# Altium schematic sheet MCU AVR ATmega2560-16AU.SchDoc
size 209 x 297 mm; Author: Мурашкин Д.В.; Address1: Address1; Address2: Address2; Address3: Address3; Address4: Address4; DocumentNumber: АБВГ.123456.001 Э3; Scale: 1:1; Letter1Column: Э; PartName: Деталь; DocumentName: 2
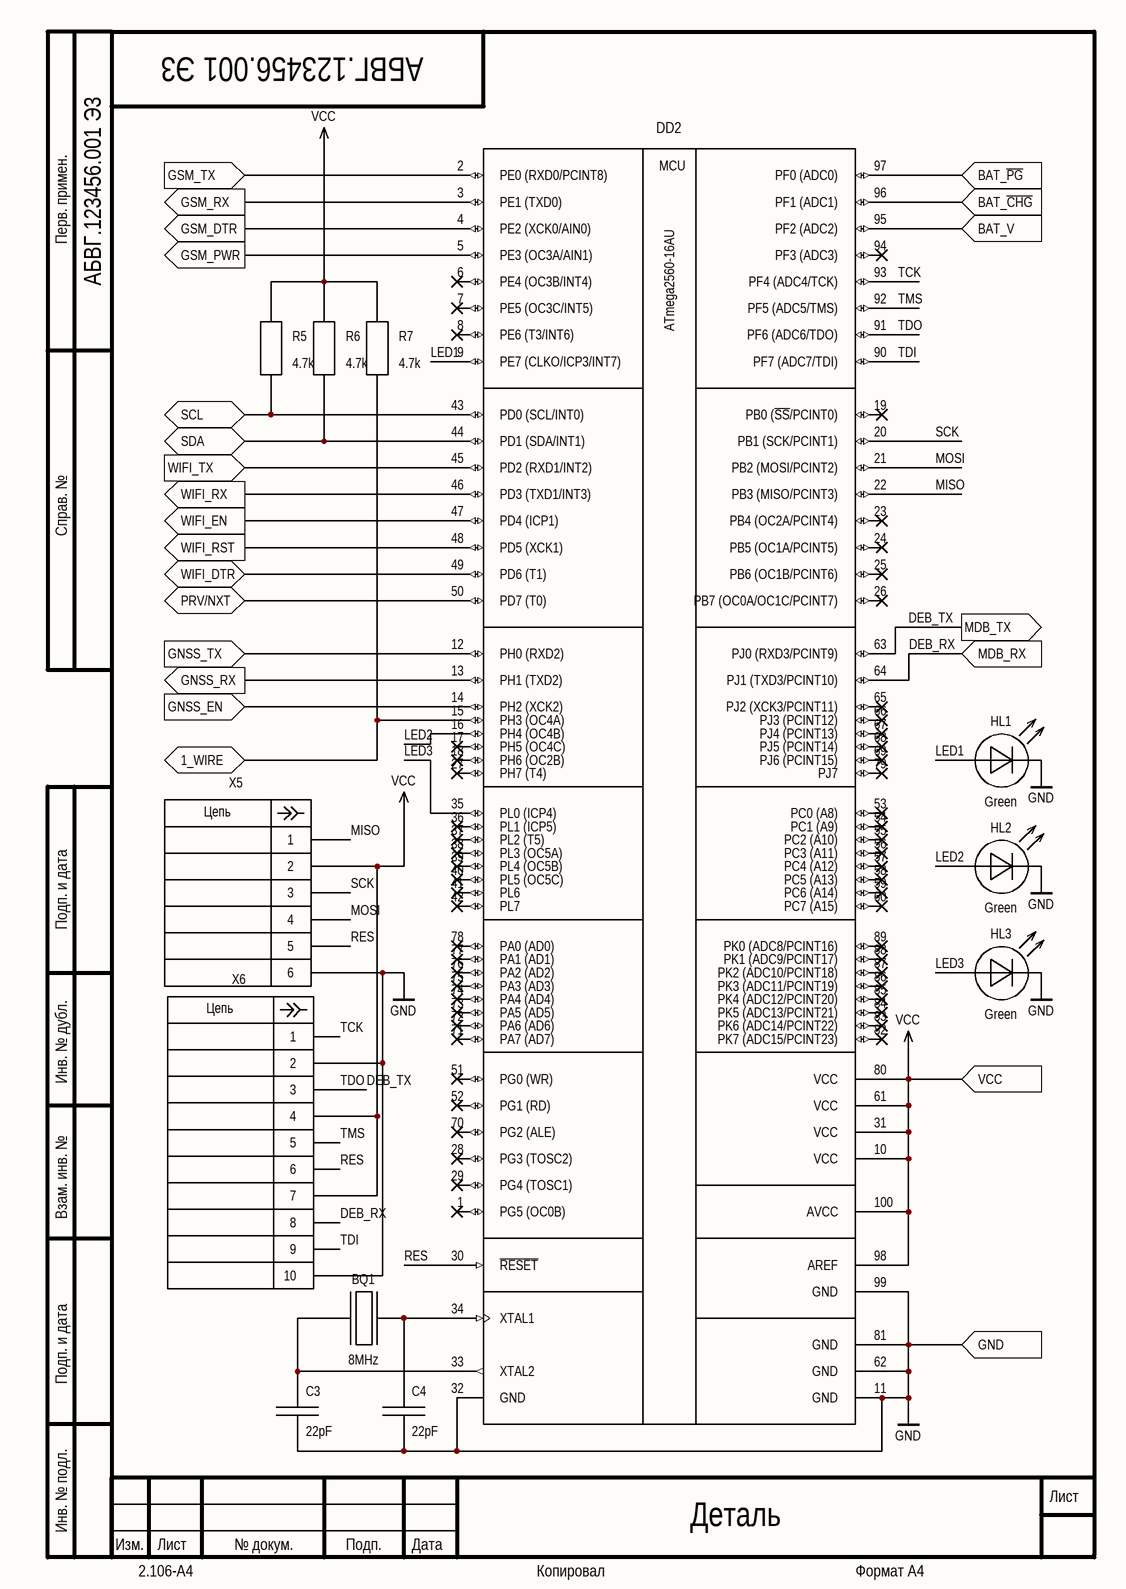
[diagram p0: MCU AVR ATmega2560-16AU.SchDoc]

## Parts
BQ1  8MHz  [HC-49S]
C3  22pF  [CAPC1608L]
C4  22pF  [CAPC1608L]
DD2  ATmega2560-16AU  [TQFP-100N]
HL1  Green  [LED 2012N]
HL2  Green  [LED 2012N]
HL3  Green  [LED 2012N]
R5  4.7k  [RESC1608L]
R6  4.7k  [RESC1608L]
R7  4.7k  [RESC1608L]
X5  Atmel ISP connector  [Atmel ISP]  (value not drawn)  (no BOM)
X6  Atmel ICE AVR JTAG connector  [Atmel ICE Connector]  (value not drawn)  (net tie, no BOM)

## Ports
1_WIRE (bidir), BAT_V (in), BAT_~{CHG} (in), BAT_~{PG} (in), GND, GNSS_EN (in), GNSS_RX (out), GNSS_TX (in), GSM_DTR (out), GSM_PWR (out), GSM_RX (out), GSM_TX (in), MDB_RX (in), MDB_TX (out), PRV/NXT (bidir), SCL (bidir), SDA (bidir), VCC, WIFI_DTR (bidir), WIFI_EN (out), WIFI_RST (out), WIFI_RX (out), WIFI_TX (in)

## Nets
GND: C3.2 C4.2 DD2.11(GND) DD2.32(GND) DD2.62(GND) DD2.81(GND) DD2.99(GND) HL1.2(Cathode) HL2.2(Cathode) HL3.2(Cathode) X5.6 X6.2 X6.10 ; port GND
VCC: DD2.10(VCC) DD2.31(VCC) DD2.61(VCC) DD2.80(VCC) DD2.98(AREF) DD2.100(AVCC) R5.1 R6.1 R7.1 X5.2 X6.4 X6.7 ; port VCC
1_WIRE: DD2.15(PH3_(OC4A)) R7.2 ; port 1_WIRE
BAT_~{CHG}: DD2.96(PF1_(ADC1)) ; port BAT_~{CHG}
BAT_~{PG}: DD2.97(PF0_(ADC0)) ; port BAT_~{PG}
BAT_V: DD2.95(PF2_(ADC2)) ; port BAT_V
DEB_RX: DD2.64(PJ1_(TXD3/PCINT10)) X6.8 ; port MDB_RX
DEB_TX: DD2.63(PJ0_(RXD3/PCINT9)) DD2.91(PF6_(ADC6/TDO)) X6.3 ; port MDB_TX  [also labelled TDO]
GNSS_EN: DD2.14(PH2_(XCK2)) ; port GNSS_EN
GNSS_RX: DD2.13(PH1_(TXD2)) ; port GNSS_RX
GNSS_TX: DD2.12(PH0_(RXD2)) ; port GNSS_TX
GSM_DTR: DD2.4(PE2_(XCK0/AIN0)) ; port GSM_DTR
GSM_PWR: DD2.5(PE3_(OC3A/AIN1)) ; port GSM_PWR
GSM_RX: DD2.3(PE1_(TXD0)) ; port GSM_RX
GSM_TX: DD2.2(PE0_(RXD0/PCINT8)) ; port GSM_TX
LED1: DD2.9(PE7_(CLKO/ICP3/INT7)) HL1.1(Anode)
LED2: DD2.16(PH4_(OC4B)) HL2.1(Anode)
LED3: DD2.35(PL0_(ICP4)) HL3.1(Anode)
MISO: DD2.22(PB3_(MISO/PCINT3)) X5.1
MOSI: DD2.21(PB2_(MOSI/PCINT2)) X5.4
PRV/NXT: DD2.50(PD7_(T0)) ; port PRV/NXT
RES: DD2.30(~{RESET}) X5.5 X6.6
SCK: DD2.20(PB1_(SCK/PCINT1)) X5.3
SCL: DD2.43(PD0_(SCL/INT0)) R5.2 ; port SCL
SDA: DD2.44(PD1_(SDA/INT1)) R6.2 ; port SDA
TCK: DD2.93(PF4_(ADC4/TCK)) X6.1
TDI: DD2.90(PF7_(ADC7/TDI)) X6.9
TMS: DD2.92(PF5_(ADC5/TMS)) X6.5
WIFI_DTR: DD2.49(PD6_(T1)) ; port WIFI_DTR
WIFI_EN: DD2.47(PD4_(ICP1)) ; port WIFI_EN
WIFI_RST: DD2.48(PD5_(XCK1)) ; port WIFI_RST
WIFI_RX: DD2.46(PD3_(TXD1/INT3)) ; port WIFI_RX
WIFI_TX: DD2.45(PD2_(RXD1/INT2)) ; port WIFI_TX
NetBQ1_1: BQ1.1 C3.1 DD2.33(XTAL2)
NetBQ1_2: BQ1.2 C4.1 DD2.34(XTAL1)

Not connected (* = marked no-connect by the designer): DD2 1(PG5_(OC0B))* 6(PE4_(OC3B/INT4))* 7(PE5_(OC3C/INT5))* 8(PE6_(T3/INT6))* 17(PH5_(OC4C))* 18(PH6_(OC2B))* 19(PB0_(~{SS}/PCINT0))* 23(PB4_(OC2A/PCINT4))* 24(PB5_(OC1A/PCINT5))* 25(PB6_(OC1B/PCINT6))* 26(PB7_(OC0A/OC1C/PCINT7))* 27(PH7_(T4))* 28(PG3_(TOSC2))* 29(PG4_(TOSC1))* 36(PL1_(ICP5))* 37(PL2_(T5))* 38(PL3_(OC5A))* 39(PL4_(OC5B))* 40(PL5_(OC5C))* 41(PL6)* 42(PL7)* 51(PG0_(WR))* 52(PG1_(RD))* 53(PC0_(A8))* 54(PC1_(A9))* 55(PC2_(A10))* 56(PC3_(A11))* 57(PC4_(A12))* 58(PC5_(A13))* 59(PC6_(A14))* 60(PC7_(A15))* 65(PJ2_(XCK3/PCINT11))* 66(PJ3_(PCINT12))* 67(PJ4_(PCINT13))* 68(PJ5_(PCINT14))* 69(PJ6_(PCINT15))* 70(PG2_(ALE))* 71(PA7_(AD7))* 72(PA6_(AD6))* 73(PA5_(AD5))* 74(PA4_(AD4))* 75(PA3_(AD3))* 76(PA2_(AD2))* 77(PA1_(AD1))* 78(PA0_(AD0))* 79(PJ7)* 82(PK7_(ADC15/PCINT23))* 83(PK6_(ADC14/PCINT22))* 84(PK5_(ADC13/PCINT21))* 85(PK4_(ADC12/PCINT20))* 86(PK3_(ADC11/PCINT19))* 87(PK2_(ADC10/PCINT18))* 88(PK1_(ADC9/PCINT17))* 89(PK0_(ADC8/PCINT16))* 94(PF3_(ADC3))*

## Notes on the sheet
- Перв. примен.
- Справ. №
- Подп. и дата
- Инв. № дубл.
- Взам. инв. №
- Инв. № подл.
- Изм.
- Лист
- № докум.
- Подп.
- Дата
- 2.106-A4
- Копировал
- Формат А4
- (in symbol ATmega2560-16AU) MCU
- (in symbol Atmel ICE AVR JTAG connector) Цепь
- (in symbol Atmel ISP connector) Цепь

## Library data of the parts
BQ1 = 9B08000037: Crystal 8MHz; Manufacturer: TXC CORPORATION; Group: Crystals, Oscillators, Resonators; Part name: 9B08000037; Package: HS-49S; Frequency: 8MHz
C3 C4 = CC0201JRNPO9BN220: Capacitor Ceramic 22pF 50V 0603(1608); Manufacturer: Yageo; Group: Ceramic Capacitors; Temperature Coefficient: C0G; Tolerance: ±5%; Voltage: 50; Type: Ceramic; Part name: CC0201JRNPO9BN220; Package: 0603 (1608); Value: 22pF
DD2 = ATmega2560-16AU: MCU MEGA; Manufacturer: Atmel; Group: Embeded microcontroller; Package: TQFP-100; Part name: ATmega2560-16AU; Distributor MSC: https://www.terraelectronica.ru/catalog_info.php?CODE=212574; Datasheet: http://www.atmel.com/devices/atmega2560.aspx
HL1-HL3 = LED 2012: LED; Manufacturer: OSRAM Opto Semiconductors Inc.; Part name: LG R971-KN-1; Group: LED Indication; Short description: LED GREEN DIFFUSED 0805 SMD; Package: 2012; Distributor: Digi-Key; Color: Green
R5-R7 = RC0603JR-074K7L: Resistor Ceramic 4.7k 0.1W 0603(1608); Manufacturer: Yageo; Group: Resistors; Temperature Coefficient: ±100ppm/°C; Tolerance: ±5%; Part name: RC0603JR-074K7L; Type: Thin Film; Power: 0.1W; Package: 0603 (1608); Value: 4.7k
X5 = Atmel ISP connector: Debug Atmel ISP Pads; Group: Connectors; Package: 6 DIP 2.54; Distributor: Atmel; Manufacturer: Atmel
X6 = Atmel ICE AVR JTAG connector: Debug AVR JTAG ICE Pads; Group: Connectors; Package: 10 DIP 1.27; Distributor: Atmel; Manufacturer: Atmel